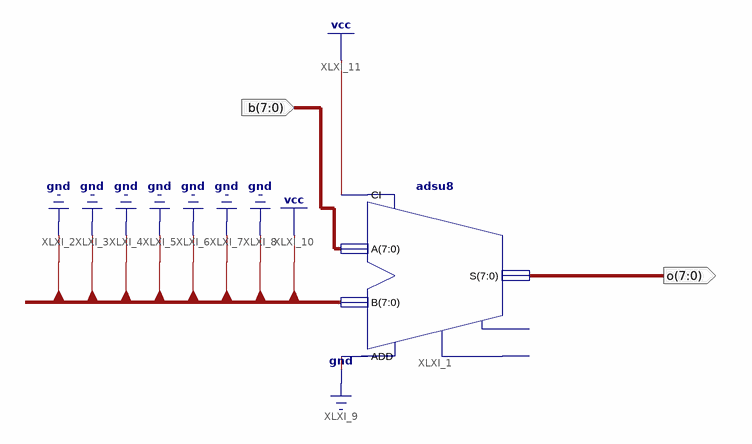
[diagram p0: schematic sheet 1]
// Xilinx ISE schematic subtract1_design.sch (spartan3) as structural Verilog: 1 symbols, 2 ports
module subtract1_design (
  input  [7:0] b,
  output [7:0] o
);

  adsu8 XLXI_1 (.A(b), .ADD(1'b0), .B(8'b00000001), .CI(1'b1), .S(o));  // open: CO, OFL
endmodule
